# Altium schematic sheet tf-CARD.SchDoc
size A4
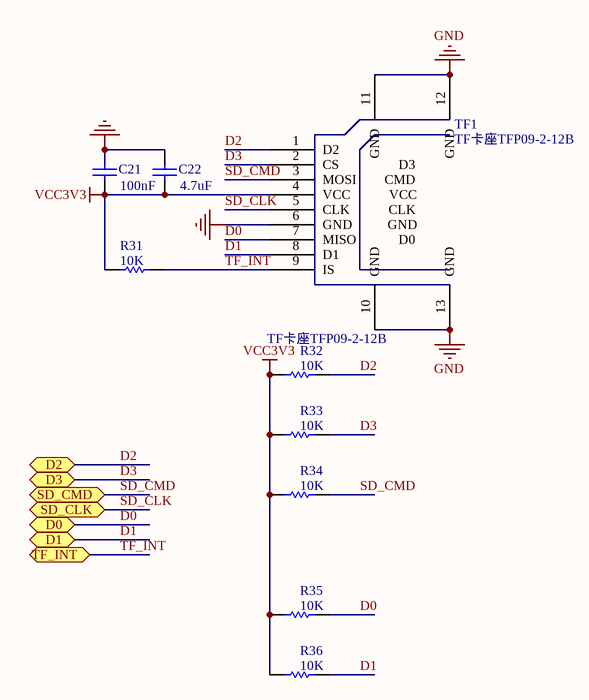
[diagram p0: tf-CARD.SchDoc]

## Parts
C21  100nF  [0402]
C22  4.7uF  [C0603N]
R31  10K  [0402]
R32  10K  [0402]
R33  10K  [0402]
R34  10K  [0402]
R35  10K  [0402]
R36  10K  [0402]
TF1  TF卡座TFP09-2-12B  [TFP09-2-12B]

## Ports
D0, D1, D2, D3, SD_CLK, SD_CMD, TF_INT (bidir)

## Nets
GND: C21.2 C22.2 TF1.6(GND__________GND) TF1.10(GND) TF1.11(GND) TF1.12(GND) TF1.13(GND)
VCC3V3: C21.1 C22.1 R31.1 R32.1 R33.1 R34.1 R35.1 R36.1 TF1.4(VCC___________VCC)
D0: R35.2 TF1.7(MISO____________D0) ; port D0
D1: R36.2 TF1.8(D1) ; port D1
D2: R32.2 TF1.1(D2) ; port D2
D3: R33.2 TF1.2(CS_________________D3) ; port D3
SD_CLK: TF1.5(CLK___________CLK) ; port SD_CLK
SD_CMD: R34.2 TF1.3(MOSI________CMD) ; port SD_CMD
TF_INT: R31.2 TF1.9(IS) ; port TF_INT

## Library data of the parts
C21 C22 = Cap: Capacitor; Published: 8-Jun-2000; LatestRevisionDate: 17-Jul-2002; LatestRevisionNote: Re-released for DXP Platform.; PackageReference: RAD-0.3; Publisher: Altium Limited
  C21: Value: 100nF
  C22: Value: 4.7uF
R31-R36 = Res Semi: Semiconductor Resistor; Published: 8-Jun-2000; LatestRevisionDate: 17-Jul-2002; LatestRevisionNote: Re-released for DXP Platform.; PackageReference: AXIAL-0.5; Publisher: Altium Limited; Value: 10K
TF1 = TF_CARD: Value: TF卡座TFP09-2-12B